# EAGLE design utilidong-lipo-charger+soc-mk-1.0 (EAGLE 7.5.0)
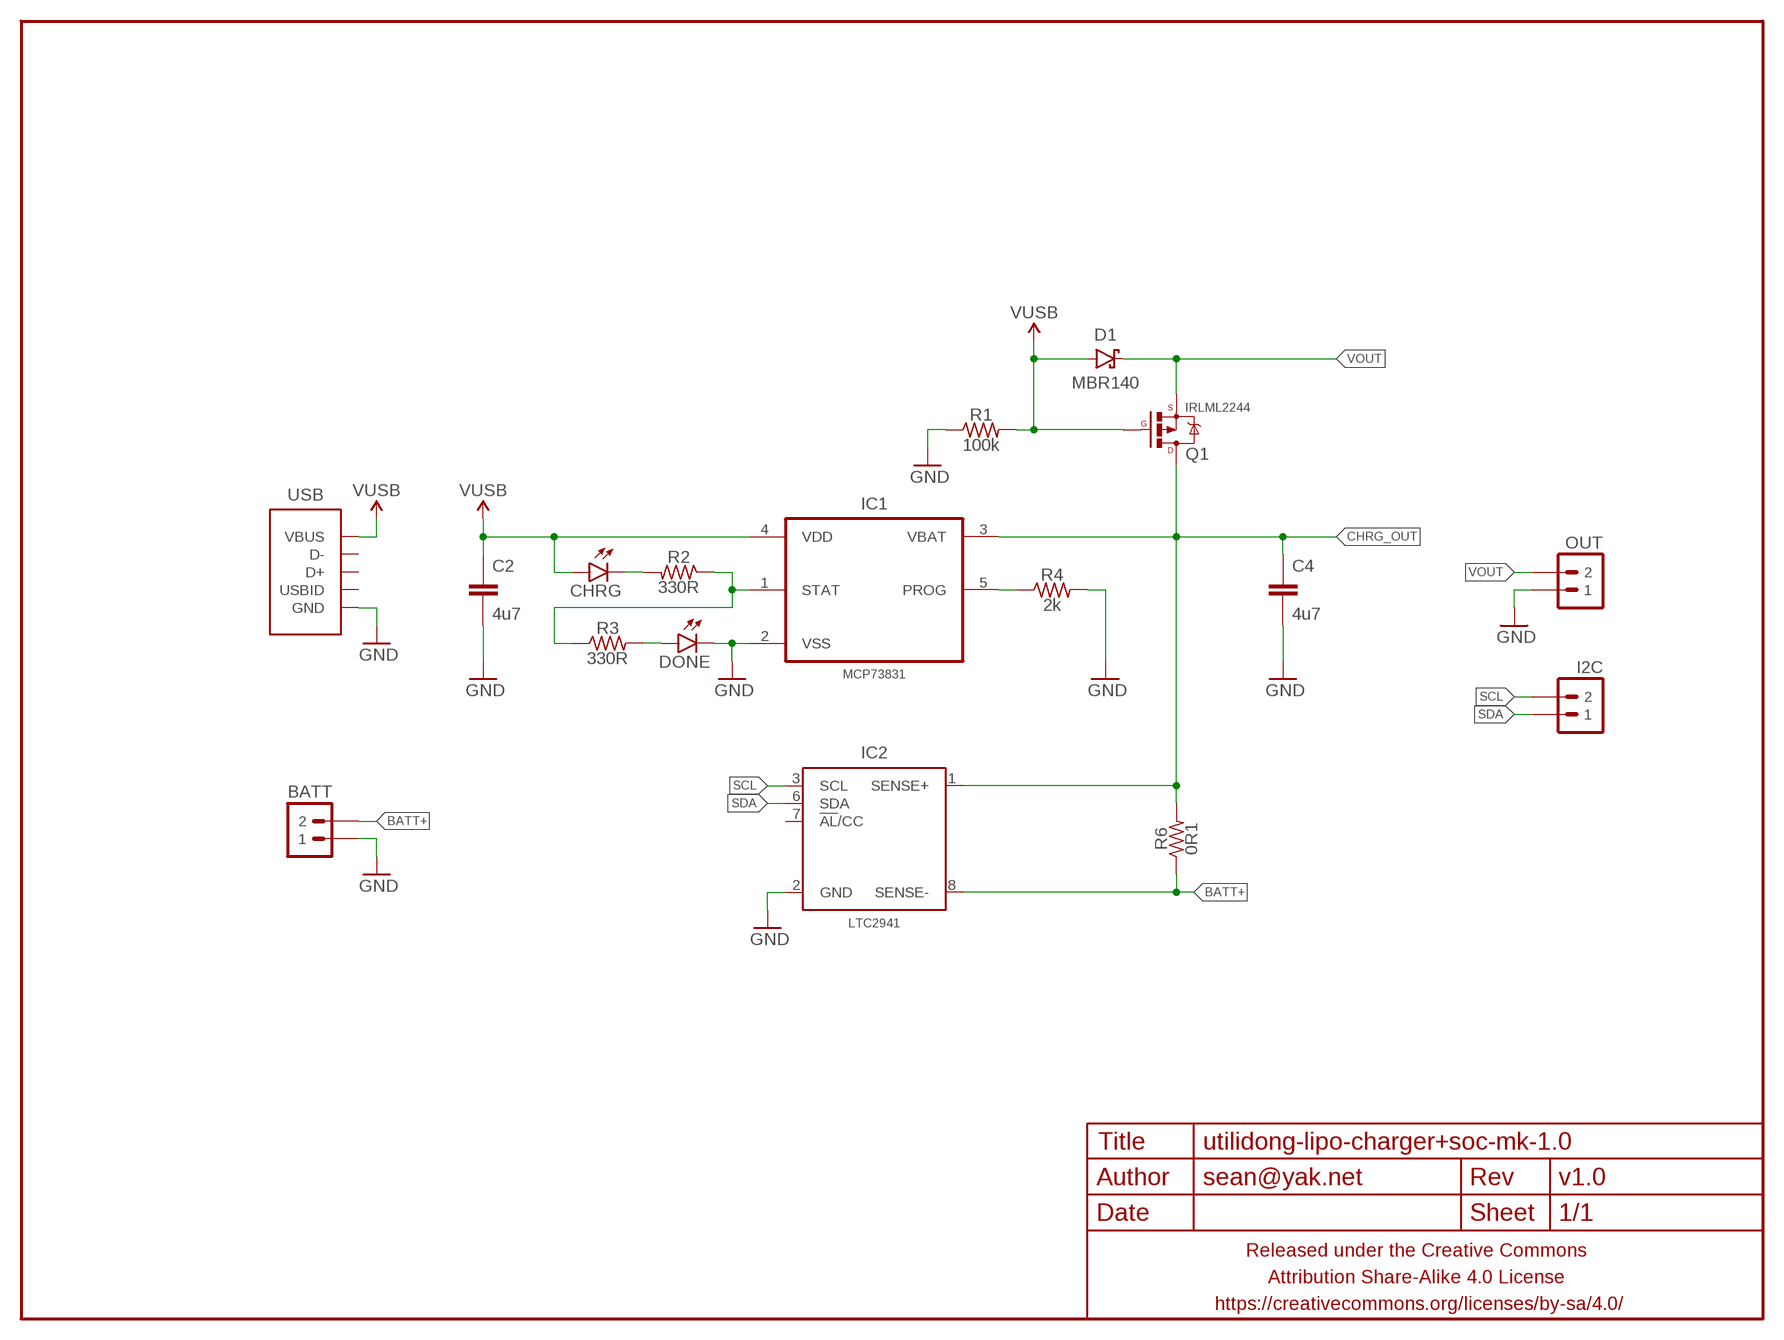
[diagram p0: schematic, sheet 1]

## Parts
BATT  M02PTH-CENTERED-R+  [1X02-CENTER-R+]
C2  4u7  CAPACITOR-CERAMICC0603  [C0603]
C4  4u7  CAPACITOR-CERAMICC0603  [C0603]
CHRG  LED0603  [LED-0603]
D1  MBR140  DIODE-SCHOTTKYSOD123  [SOD123-SCHOTTKY]
DONE  LED0603  [LED-0603]
FRAME1  FRAME-LETTERNO_PACKAGE  [DUMMY]
I2C  M02PTH  [1X02]
IC1  MCP73831  MCP73831T-2ACI/OT  [SOT95P280X145-5N]
IC2  LTC2941  LTC2941MSOP-8  [MSOP-8]
OUT  M02PTH-CENTERED-R+  [1X02-CENTER-R+]
Q1  IRLML2244  MOSFET-PCHANNELIRLML2244  [SOT23-3]
R1  100k  RESISTORR0603  [R0603]
R2  330R  RESISTORR0603  [R0603]
R3  330R  RESISTORR0603  [R0603]
R4  2k  RESISTORR0603  [R0603]
R6  0R1  RESISTORR0603  [R0603]
USB  USB-ABFCI-10103594-USB-MICRO-B-LESS  [FCI-10103594-USB-MICRO-B-LESS]

## Nets
BATT+: BATT.2 IC2.8(SENSE-) R6.1
CHRG_OUT: C4.1 IC1.3(VBAT) IC2.1(SENSE+) Q1.3(D) R6.2
GND: BATT.1 C2.2 C4.2 DONE.C IC1.2(VSS) IC2.2(GND) OUT.1 R1.1 R4.2 USB.5(GND)
N$1: CHRG.C R2.2
N$2: DONE.A R3.2
N$3: IC1.1(STAT) R2.1 R3.1
N$8: IC1.5(PROG) R4.1
SCL: I2C.2 IC2.3(SCL)
SDA: I2C.1 IC2.6(SDA)
VOUT: D1.C OUT.2 Q1.2(S)
VUSB: C2.1 CHRG.A D1.A IC1.4(VDD) Q1.1(G) R1.2 USB.1(VBUS)
Unconnected: IC2.7(!AL!/CC) USB.2(D-) USB.3(D+) USB.4(USBID)

## Library data of the parts
BATT I2C OUT = A_butts:M02: Standard 2-pin 0.1" header. Use with - straight break away headers ( PRT-00116) - right angle break away headers (PRT-00553) - swiss pins (PRT-00743) - machine pins (PRT-00117) - female headers (PRT-00115) Molex polarized connector foot print use with: PRT-08233 with associated crimp pins and housings. 2.54_SCREWTERM for use with PRT-10571. 3.5mm Screw Terminal footprints for PRT-08084 5mm Screw Terminal footprints for use with PRT-08433
C2 C4 = a_parts:CAPACITOR-CERAMIC: CAPACITOR, European symbol
CHRG DONE = a_parts:LED: LEDs Standard schematic elements and footprints for 5mm, 3mm, 1206, and 0603 sized LEDs. 5mm - Spark Fun Electronics SKU : COM-00529 (and others)
D1 = a_parts:DIODE-SCHOTTKY: Schottky diodes in SFE's production catalog BAT20J 1A 23V 0.62Vf RB751 120mA 40V 0.37Vf PMEG4005EJ 0.5A 40V 0.42Vf MBRA140 1A 40V 0.5Vf B340A 3A 40V SMA
FRAME1 = A_butts:FRAME-LETTER: Schematic Frame Standard 8.5x11 US Letter frame; DESIGNER: sean@yak.net; VERSION: v1.0
IC1 = A_butts:MCP73831T-2ACI/OT: Charge Management Controller; MPN: MCP73831T-2ACI/OT; OC_FARNELL: 1332158; OC_NEWARK: 56K7045; PACKAGE: SOT-5; SUPPLIER: Microchip
IC2 = a_parts:LTC2941
Q1 = A_butts:MOSFET-PCHANNEL: Generic PMOSFET IRLML2244 - TRANS-11153 (SOT-23 -20V -4.3A) (1.Gate 2.Source 3.Drain) FQP27P06 - COM-10349 <http://www.sparkfun.com/products/10349> (TO-220 -60V -27A) (1.Gate 2.Source 3.Drain); PROD_ID: TRANS-11153
R1-R4 R6 = A_butts:RESISTOR: RESISTOR, American symbol
USB = A_butts:USB-AB: This is a USB AB connector that is compatible with USB OTG. i.e. this connector can serve as a host or device

## Board
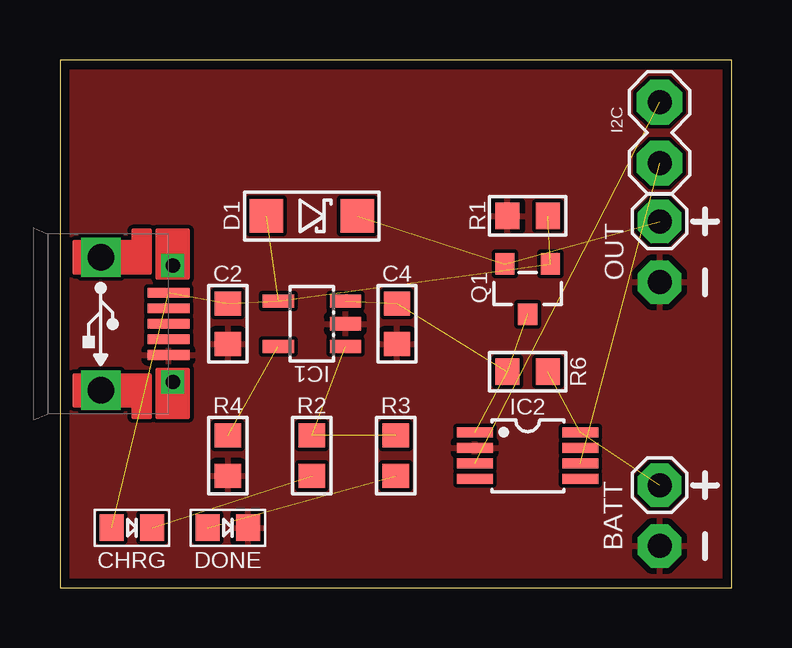
[diagram p1: board, top side]
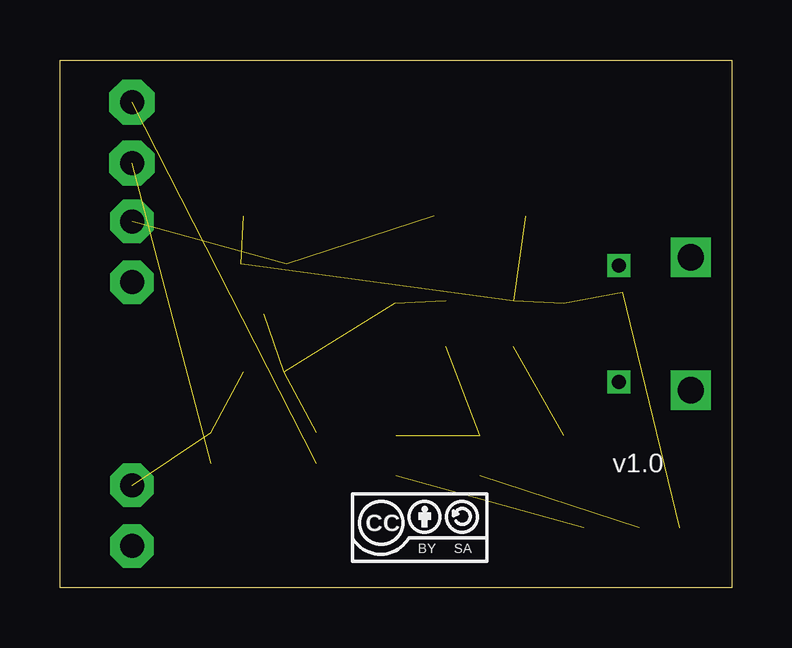
[diagram p2: board, bottom side, seen from below]

Size 28 x 22 mm. Coordinates in mm from the lower left corner, seen from the top.
Outline: 28,0 28,22 0,22 0,0 28,0
Copper layers (1*16): Top 0.0356mm / dielectric 1.5011mm / Bottom 0.0356mm
Design rules "LaenPCBOrder_2": minimum track width 6mil, minimum drill 13mil, track to track 6mil, track to pad 6mil, pad to pad 6mil, via to via 6mil, smd to smd 6mil, copper to edge 15mil, drill to drill 6mil, minimum pad ring 7mil, minimum via ring 7mil, stop-mask expansion 3mil, vias tented up to drill 20mil, thermal gap 10mil

### Footprints (pad centres in the part's own frame; a part is rotated, then mirrored left to right if it is on the bottom)
1X02-CENTER-R+ = drill 1 pad 1.8 octagon: 1 -1.27,0; 2 1.27,0
C0603 = smd 1 x 1.1: 1 -0.85,0; 2 0.85,0
LED-0603 = smd 1.1 x 1: A 0,-0.85; C 0,0.85
SOD123-SCHOTTKY = smd 1.4 x 1.4: A -1.9,0; C 1.9,0
1X02 = drill 1 pad 1.88 octagon: 1 0,0; 2 2.54,0
SOT95P280X145-5N = smd 1.3 x 0.55: 1 -1.4,0.95; 2 -1.4,0; 3 -1.4,-0.95; 4 1.4,-0.95; 5 1.4,0.95
MSOP-8 = smd 1.5 x 0.42: 1 -2.2,0.975; 2 -2.2,0.325; 3 -2.2,-0.325; 4 -2.2,-0.975; 5 2.2,-0.975; 6 2.2,-0.325; 7 2.2,0.325; 8 2.2,0.975
SOT23-3 = smd 0.8 x 0.9: 1 -0.95,-1; 2 0.95,-1; 3 0,1.1
R0603 = smd 1 x 1.1: 1 -0.85,0; 2 0.85,0
FCI-10103594-USB-MICRO-B-LESS = smd 0.4 x 1.75: 1 -1.3,2.825; 2 -0.65,2.825; 3 0,2.825; 4 0.65,2.825; 5 1.3,2.825 | drill 0.6 square: SHIELD@1 -2.425,3; SHIELD@2 2.425,3 | drill 1.1 pad 1.3 square: SHIELD@3 -2.775,0; SHIELD@4 2.775,0

### Placement (x,y rotation side)
BATT  25,3 90 top
C2  7,11 270 top
C4  14.05,11 270 top
CHRG  3,2.5 270 top
D1  10.5,15.5 0 top
DONE  7,2.5 270 top
FRAME1  0,0 0 top
I2C  25,17.7 90 top
IC1  10.5,11 180 top
IC2  19.5,5.5 0 top
OUT  25,14 90 top
Q1  19.5,12.5 180 top
R1  19.5,15.5 0 top
R2  10.5,5.5 270 top
R3  14,5.5 270 top
R4  7,5.5 270 top
R6  19.5,9 180 top
U$8  [CC-BY-SA-4.0-NO-URL]  13,2.5 0 bottom
USB  1.7,11 270 top

### Tracks (layer width: path | path; a pad name or v marks a point on that pad's centre or on a via)
BATT+  (2 unrouted)
CHRG_OUT  (4 unrouted)
GND
  pour Top: 0,0 0,22 28,22 28,0
N$1  (1 unrouted)
N$2  (1 unrouted)
N$3  (2 unrouted)
N$8  (1 unrouted)
SCL  (1 unrouted)
SDA  (1 unrouted)
VOUT  (2 unrouted)
VUSB  (6 unrouted)